# EAGLE design Hooly_2.022 (EAGLE 8.5.1)
SHT31 con connettore Tutto 1206 anzichè 0603 Con regolatore all'ingresso Variante Con quarzo non SMD Partitore a VBATT per misurare livello batteria
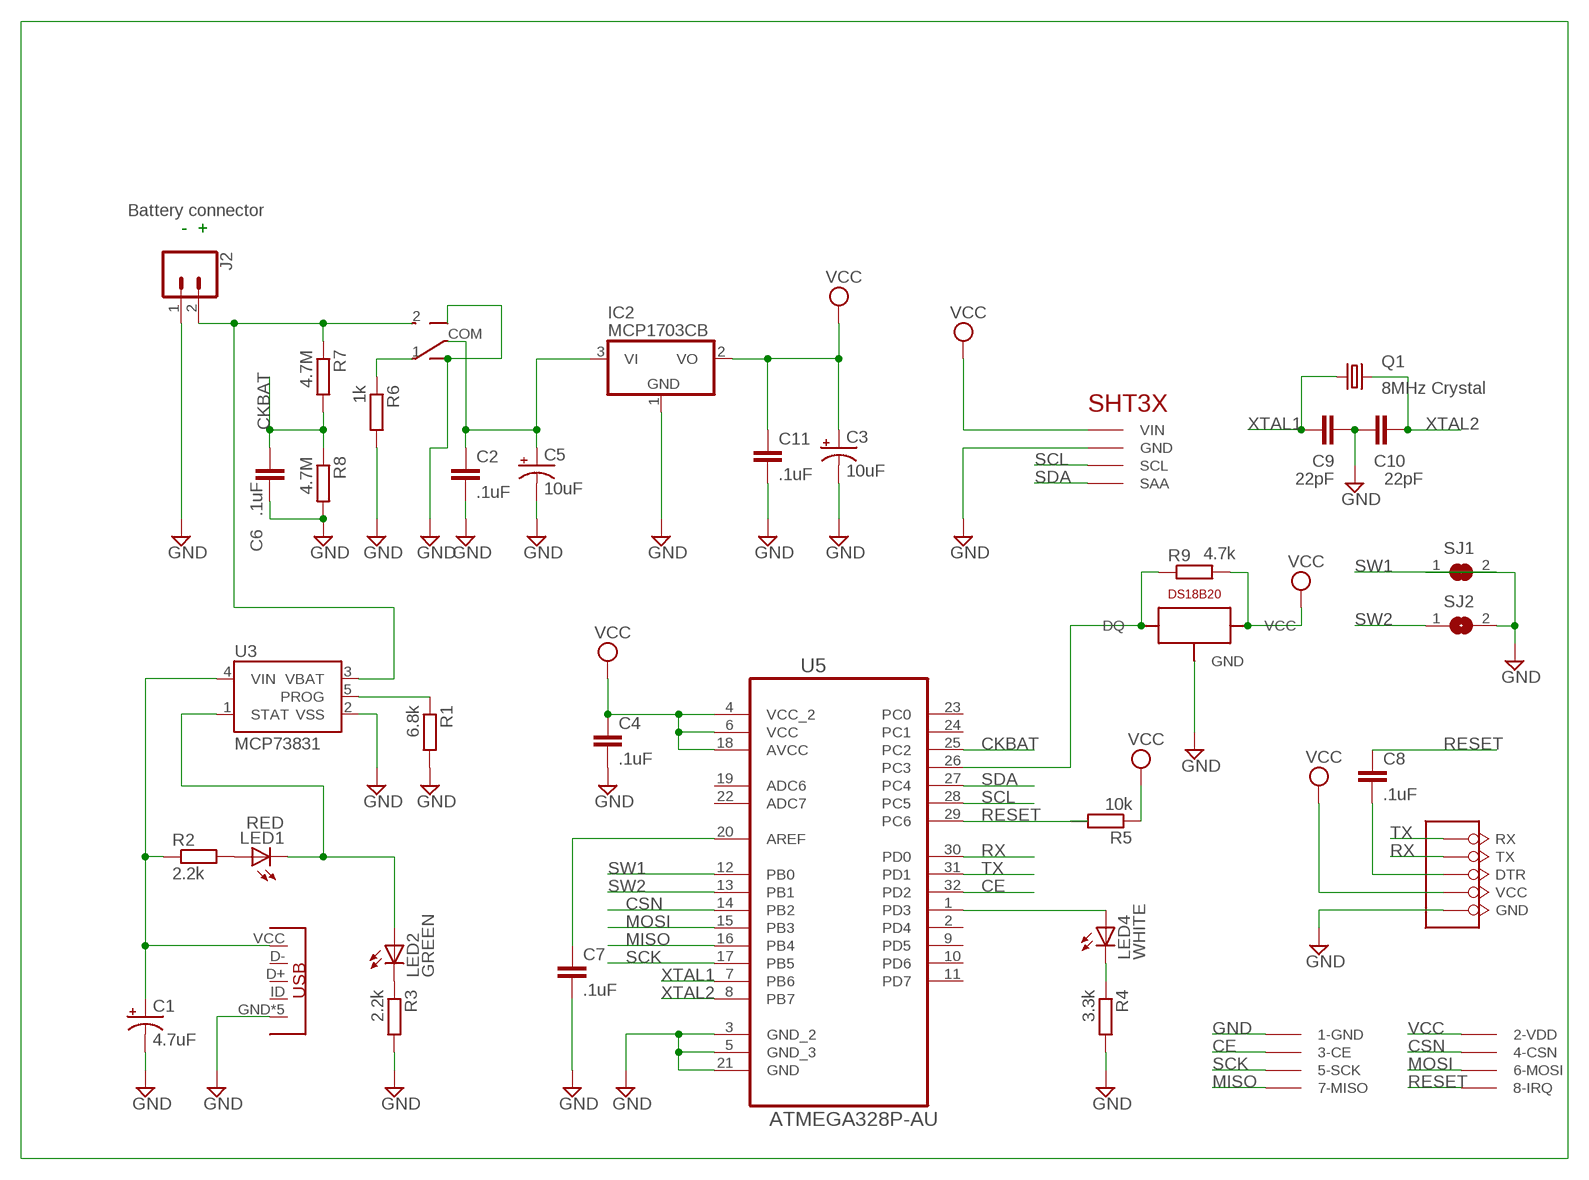
[diagram p0: schematic, sheet 1]

## Parts
C1  4.7uF  10UF-POLAR-RADIAL-2.5MM-25V-20%  [CPOL-RADIAL-2.5MM-5MM]
C2  .1uF  C-EUC1206  [C1206]
C3  10uF  10UF-POLAR-RADIAL-2.5MM-25V-20%  [CPOL-RADIAL-2.5MM-5MM]
C4  .1uF  C-EUC1206  [C1206]
C5  10uF  10UF-POLAR-RADIAL-2.5MM-25V-20%  [CPOL-RADIAL-2.5MM-5MM]
C6  .1uF  C-EUC1206  [C1206]
C7  .1uF  C-EUC1206  [C1206]
C8  .1uF  C-EUC1206  [C1206]
C9  22pF  C-EUC0603K  [C0603K]
C10  22pF  C-EUC0603K  [C0603K]
C11  .1uF  C-EUC1206  [C1206]
IC2  MCP1703CB  [SOT23]
J2  CONN_02  [1X02]
LED1  RED  LEDCHIPLED_1206  [CHIPLED_1206]
LED2  GREEN  LEDCHIPLED_1206  [CHIPLED_1206]
LED4  WHITE  LEDCHIPLED_1206  [CHIPLED_1206]
Q1  8MHz Crystal  KX-9B  [5.0X3.2_2]
R1  6.8k  R-EU_R1206  [R1206]
R2  2.2k  R-EU_R1206  [R1206]
R3  2.2k  R-EU_R1206  [R1206]
R4  3.3k  R-EU_R1206  [R1206]
R5  10k  R-EU_R1206  [R1206]
R6  1k  R-EU_R1206  [R1206]
R7  4.7M  R-EU_R1206  [R1206]
R8  4.7M  R-EU_R1206  [R1206]
R9  4.7k  R-EU_R1206  [R1206]
SJ1  SJ  [SJ]
SJ2  SJ  [SJ]
U3  MCP73831  [SOT23-5]
U5  ATMEGA328P-AU  [QFP80P900X900X120-32N]
U$1  SHT3XLARGE  [MYSHT3X]
U$2  MYSWITCH2MM  [MYSWITCH]
U$3  MYDS18B20  [MYDS18B20]
U$4  MYNRF24L01SOCKET  [MYNRF24L01SOCKET]
U$6  FTDI232  [FTDI232]
U$7  MYMICROUSB  [MYMICROUSB]

## Nets
CE: U5.32(PD2) U$4.CE(3-CE)
CKBAT: C6.1 R7.2 R8.1 U5.25(PC2)
CSN: U5.14(PB2) U$4.CSN(4-CSN)
DTR: C8.2 U$6.DTR
GND: C1.2(-) C2.2 C3.2(-) C4.2 C5.2(-) C6.2 C7.2 C9.2 C10.1 C11.2 IC2.1(GND) J2.1 R1.2 R3.2 R4.2 R6.2 R8.2 SJ1.1 SJ2.2 U3.2(VSS) U5.3(GND_2) U5.5(GND_3) U5.21(GND) U$1.GND U$2.GND1 U$2.GND2 U$3.GND U$4.GND(1-GND) U$6.GND U$7.GND U$7.P$6(GND) U$7.P$7(GND) U$7.P$8(GND) U$7.P$9(GND)
MISO: U5.16(PB4) U$4.MISO(7-MISO)
MOSI: U5.15(PB3) U$4.MOSI(6-MOSI)
N$2: C2.1 C5.1(+) IC2.3(VI) U$2.COM
N$3: LED4.A U5.1(PD3)
N$5: LED1.A R2.2
N$7: LED2.C R3.1
N$8: LED1.C LED2.A U3.1(STAT)
N$9: R6.1 U$2.1
N$10: R1.1 U3.5(PROG)
N$12: C7.1 U5.20(AREF)
N$13: R9.1 U5.26(PC3) U$3.DQ
N$14: LED4.C R4.1
RESET: C8.1 R5.2 U5.29(PC6) U$4.IRQ(8-IRQ)
RX: U5.30(PD0) U$6.TX
SCK: U5.17(PB5) U$4.SCK(5-SCK)
SCL: U5.28(PC5) U$1.SCL
SDA: U5.27(PC4) U$1.SAA
SW1: SJ1.2 U5.12(PB0)
SW2: SJ2.1 U5.13(PB1)
TX: U5.31(PD1) U$6.RX
VBATT: J2.2 R7.1 U3.3(VBAT) U$2.2
VCC: C3.1(+) C4.1 C11.1 IC2.2(VO) R5.1 R9.2 U5.4(VCC_2) U5.6(VCC) U5.18(AVCC) U$1.VIN U$3.VCC U$4.VDD(2-VDD) U$6.VCC
VUSB: C1.1(+) R2.1 U3.4(VIN) U$7.VCC
XTAL1: C9.1 Q1.1 U5.7(PB6)
XTAL2: C10.2 Q1.2 U5.8(PB7)
Unconnected: U5.2(PD4) U5.9(PD5) U5.10(PD6) U5.11(PD7) U5.19(ADC6) U5.22(ADC7) U5.23(PC0) U5.24(PC1) U$7.D+ U$7.D- U$7.ID

## Notes on the sheet
- Battery connector
- -  + | -  + | -  + | -  + | -  +

## Library data of the parts
C1 = SparkFun-Capacitors:10UF-POLAR: 10.0µF polarized capacitors A capacitor is a passive two-terminal electrical component used to store electrical energy temporarily in an electric field.; PROD_ID: CAP-08440; VALUE: 10uF
C2 C4 C6-C8 C11 = resistor:C-EU: CAPACITOR, European symbol
C3 C5 = SparkFun-Capacitors:10UF-POLAR: 10.0µF polarized capacitors A capacitor is a passive two-terminal electrical component used to store electrical energy temporarily in an electric field.; PROD_ID: CAP-08440
C9 C10 = rcl:C-EU: CAPACITOR, European symbol; SPICEPREFIX: C
IC2 = linear:MCP1703: 250 mA, 16V, Low Quiescent Current LDO Regulator Source: http://ww1.microchip.com/downloads/en/DeviceDoc/22049b.pdf
J2 = SparkFun-Connectors:CONN_02: Multi connection point. Often used as Generic Header-pin footprint for 0.1 inch spaced/style header connections On any of the 0.1 inch spaced packages, you can populate with these: Break Away Headers - Straight <https://www.sparkfun.com/products/116> (PRT-00116) Break Away Male Headers - Right Angle <https://www.sparkfun.com/products/553> (PRT-00553) Female Headers <https://www.sparkfun.com/products/115> (PRT-00115) Break Away Headers - Machine Pin <https://www.sparkfun.com/products/117> (PRT-00117) Break Away Female Headers - Swiss Machine Pin <https://www.sparkfun.com/products/743> (PRT-00743) For SCREWTERMINALS and SPRING TERMINALS visit here: Screw Terimnals on SparkFun.com <https://www.sparkfun.com/search/results?term=Screw+Terminals> (5mm/3.5mm/2.54mm spacing) This device is also useful as a general connection point to wire up your design to another part of your project. Our various solder wires solder well into these plated through hole pads. Hook-Up Wire - Assortment (Stranded, 22 AWG) <https://www.sparkfun.com/products/11375> (PRT-11375) Hook-Up Wire - Assortment (Solid Core, 22 AWG) <https://www.sparkfun.com/products/11367> (PRT-11367) View the entire wire category on our website here <https://www.sparkfun.com/categories/141> Special notes: Molex polarized connector foot print use with: PRT-08233 with associated crimp pins and housings. 2.54_SCREWTERM for use with PRT-10571. 3.5mm Screw Terminal footprints for PRT-08084 5mm Screw Terminal footprints for use with PRT-08432
LED1 LED2 LED4 = led:LED: LED OSRAM: - CHIPLED LG R971, LG N971, LY N971, LG Q971, LY Q971, LO R971, LY R971 LH N974, LH R974 LS Q976, LO Q976, LY Q976 LO Q996 - Hyper CHIPLED LW Q18S LB Q993, LB Q99A, LB R99A - SideLED LS A670, LO A670, LY A670, LG A670, LP A670 LB A673, LV A673, LT A673, LW A673 LH A674 LY A675 LS A676, LA A676, LO A676, LY A676, LW A676 LS A679, LY A679, LG A679 - Hyper Micro SIDELED® LS Y876, LA Y876, LO Y876, LY Y876 LT Y87S - SmartLED LW L88C, LW L88S LB L89C, LB L89S, LG L890 LS L89K, LO L89K, LY L89K LS L896, LA L896, LO L896, LY L896 - TOPLED LS T670, LO T670, LY T670, LG T670, LP T670 LSG T670, LSP T670, LSY T670, LOP T670, LYG T670 LG T671, LOG T671, LSG T671 LB T673, LV T673, LT T673, LW T673 LH T674 LS T676, LA T676, LO T676, LY T676, LB T676, LH T676, LSB T676, LW T676 LB T67C, LV T67C, LT T67C, LS T67K, LO T67K, LY T67K, LW E67C LS E67B, LA E67B, LO E67B, LY E67B, LB E67C, LV E67C, LT E67C LW T67C LS T679, LY T679, LG T679 LS T770, LO T770, LY T770, LG T770, LP T770 LB T773, LV T773, LT T773, LW T773 LH T774 LS E675, LA E675, LY E675, LS T675 LS T776, LA T776, LO T776, LY T776, LB T776 LHGB T686 LT T68C, LB T68C - Hyper Mini TOPLED® LB M676 - Mini TOPLED Santana® LG M470 LS M47K, LO M47K, LY M47K Source: http://www.osram.convergy.de LUXEON: - LUMILED® LXK2-PW12-R00, LXK2-PW12-S00, LXK2-PW14-U00, LXK2-PW14-V00 LXK2-PM12-R00, LXK2-PM12-S00, LXK2-PM14-U00 LXK2-PE12-Q00, LXK2-PE12-R00, LXK2-PE12-S00, LXK2-PE14-T00, LXK2-PE14-U00 LXK2-PB12-K00, LXK2-PB12-L00, LXK2-PB12-M00, LXK2-PB14-N00, LXK2-PB14-P00, LXK2-PB14-Q00 LXK2-PR12-L00, LXK2-PR12-M00, LXK2-PR14-Q00, LXK2-PR14-R00 LXK2-PD12-Q00, LXK2-PD12-R00, LXK2-PD12-S00 LXK2-PH12-R00, LXK2-PH12-S00 LXK2-PL12-P00, LXK2-PL12-Q00, LXK2-PL12-R00 Source: www.luxeon.com KINGBRIGHT: KA-3528ASYC Source: www.kingbright.com
Q1 = crystal-geyer_V1_0:KX: Quartz Crystals (MHz) SMD: KX - Serie Model Size l/w/h [mm] Frequency Range Frequency Stability Temp. Range [°C] Load Capacitance AECQ 200 availabel Datasheet KX-4 KX-5 KX-6 KX-7 KX-9A KX-9B KX-12A KX-12B KX-13 KX-20 KX-K KX-KS 1.6/1.2/0.3 2.0/1.6/0.45 2.5/2.0/0.55 3.2/2.5/0.8 5.0/3.2/1.0 5.0/3.2/1.1 6.0/3.5/1.1 6.0/3.5/1.0 7.0/5.0 /1.3 11.6/5.5/1.6 12.3/4.5/4.2 12.3/4.5/3.2 24.0 ~ 80.0 MHz 16.0 ~ 80.0 MHz 12.0 ~ 80.0 MHz 8.0 ~ 60.0 MHz 7,68 ~ 300,0 MHz 8,0 ~ 50,0 MHz 8,0 ~ 150,0 MHz 8,0 ~ 50,0 MHz 6,0 ~ 160,0 MHz 3,579 ~ 25,0 MHz 3,579 ~ 70,0 MHz 3,579 ~ 70,0 MHz ±10 … ±50ppm ±10 … ±50ppm ±10 … ±50ppm ±10 … ±50ppm ±10 … ±50ppm ±10 … ±50ppm ±10 … ±50ppm ±10 … ±50ppm ±10 … ±50ppm ±50ppm ±10 … ±50ppm ±10 … ±50ppm (*) -40°C …+85°C (*) -40°C …+125°C (*) -40°C …+125°C (*) -40°C …+125°C (*) -40°C …+105°C (*) -40°C …+105°C (*) -40°C …+125°C (*) -40°C …+105°C (*) -40°C …+105°C (*) -40°C …+105°C (*) -40°C …+85°C (*) -40°C …+85°C 8, 8…16 8, 8…16 10, 8…16 12, 7…20 16, 10…20 16, 10…20 16, 10…20 16, 12…20 16, 12…20 16, 12…20 16, 12…30 16, 12…30 - yes yes yes - - - - - - - - KX-4.pdf <http://www.geyer-electronic.de/uploads/tx_userartikelfrequenz/GEYER-KX-4.pdf> KX-5.pdf <http://www.geyer-electronic.de/uploads/tx_userartikelfrequenz/GEYER-KX-5.pdf> KX-6.pdf <http://www.geyer-electronic.de/uploads/tx_userartikelfrequenz/GEYER-KX-6.pdf> KX-7.pdf <http://www.geyer-electronic.de/uploads/tx_userartikelfrequenz/GEYER-KX-7.pdf> KX-9A.pdf <http://www.geyer-electronic.de/uploads/tx_userartikelfrequenz/GEYER-KX-9A.pdf> KX-9B.pdf <http://www.geyer-electronic.de/uploads/tx_userartikelfrequenz/GEYER-KX-9B.pdf> KX-12A.pdf <http://www.geyer-electronic.de/uploads/tx_userartikelfrequenz/GEYER-KX-12A.pdf> KX-12B.pdf <http://www.geyer-electronic.de/uploads/tx_userartikelfrequenz/GEYER-KX-12B.pdf> KX-13.pdf <http://www.geyer-electronic.de/uploads/tx_userartikelfrequenz/GEYER-KX-13.pdf> KX-20.pdf <http://www.geyer-electronic.de/uploads/tx_userartikelfrequenz/GEYER-KX-20.pdf> KX-K.pdf <http://www.geyer-electronic.de/uploads/tx_userartikelfrequenz/GEYER-KX-K.pdf> KX-KS.pdf <http://www.geyer-electronic.de/uploads/tx_userartikelfrequenz/GEYER-KX-KS.pdf> <http://www.geyer-electronic.de/fileadmin/template/img/logo-geyer-electronic.png> Details see: http://www.geyer-electronic.de/Frequenz-Produkte.9.0.html Created 2016-06-07, Hans Locher 2016 (C) Geyer Quartz Technology KX4,KX5,KX6,KX7,KX9A,KX9B,KX12A,KX12B,KX13,KX20,KXK,KXKS;1612;2016;2520;3225;5032;6035;7050;11655;12345;1,6x1,2;2,0x1,6;2,5x2,0;3,2x2,5;5,0x3,2;6,0x3,5;7,0x5,0;11,6x5,5;12,3x4,5;12,3x4,5;1.6x1.2;2.0x1.6;2.5x2.0;3.2x2.5;5.0x3.2;6.0x3.5;7.0x5.0;11.6x5.5;12.3x4.5;12.3x4.5;
R1-R9 = rcl:R-EU_: RESISTOR, European symbol
SJ1 SJ2 = jumper:SJ: SMD solder JUMPER
U3 = SparkFun-IC-Power:MCP73831: MCP73831T Li-Ion, Li-Pol Controller Miniature single cell, fully integrated Li-Ion, Li-polymer charge management controller Datasheet <http://ww1.microchip.com/downloads/en/DeviceDoc/20001984g.pdf> SparkFun Products: SparkFun ESP32 Thing <https://www.sparkfun.com/products/13907> SparkFun 9DoF Razor IMU M0 <https://www.sparkfun.com/products/14001>; PROD_ID: IC-09995
U5 = Atmel_By_element14_Batch_1-00:ATMEGA328P-AU: 8-bit Microcontroller with In-System Programmable Flash; MPN: ATMEGA328P-AU; OC_FARNELL: 1715486; OC_NEWARK: 14R4631; PACKAGE: TQFP-32; SUPPLIER: Atmel
U$1 = My_library:SHT3X
U$2 = My_library:MYSWITCH2MM: Slide switch 2mm pitch
U$3 = My_library:MYDS18B20
U$4 = My_library:MYNRF24L01SOCKET
U$6 = My_library:FTDI232
U$7 = My_library:MYMICROUSB: MicroUSB connectori SMD https://it.aliexpress.com/item/100pcs-Micro-USB-Connector-5pin-Seat-Jack-Micro-usb-Four-legs-5P-Inserting-plate-seat-MIni/32708224969.html?spm=a2g0s.13010208.99999999.262.eblQws

## Net classes
0 default: clearance 0.508 mm

## Board
// Funziona, provato con Hooly 2.021 autocostruito #include #include "Adafruit_SHT31.h" #include #include #include #define ledPin 3 #define ECP 1 // EEPROM register where store info for pause between trasmission #define NETWORKID 0 // Must be the same for all nodes #define MYNODEID 2 // Trasmitter node ID #define TONODEID 1 // Destination node ID #define FREQUENCY RF69_433MHZ Adafruit_SHT31 sht31 = Adafruit_SHT31(); RFM69 radio; int counter=0; int nodeID=5555; int period=5; // ------------------------- void setup() { pinMode(ledPin, OUTPUT); Serial.begin(57600); sht31.begin(0x44); radio.initialize(FREQUENCY, MYNODEID, NETWORKID); radio.setHighPower(); } // ------------------------- void loop() { delay(10); char outBuffer[32]= ""; byte outBufferLen; long start_timer=millis(); int temp = sht31.readTemperature() * 100; int hum = sht31.readHumidity() * 100; long vcc = readVcc(); int b = nodeID; int c = counter; int dt = temp; int dh = hum; int e = vcc; int f = period; sprintf(outBuffer, "%04d:%04d:%04d:%04d:%04d:%04d",b,c,dt,dh,e,f); outBufferLen = strlen(outBuffer); Serial.print("Vcc = "); Serial.println(vcc); Serial.print("Temp *C = "); Serial.println(temp); Serial.print("Hum. % = "); Serial.println(hum); Serial.print("Measurament time = "); Serial.println((millis() - start_timer)); start_timer=millis(); Serial.print("Counter = "); Serial.println(counter); Serial.println(outBuffer); digitalWrite(ledPin, HIGH); radio.send(TONODEID, outBuffer, outBufferLen); delay(10); digitalWrite(ledPin, LOW); Serial.print("Trasmission time = "); Serial.println((millis() - start_timer)); Serial.println(); if(counter == 9999) counter = 0; else counter ++; delay(10); gotosleep(period); delay(10); } // ------------------------- void gotosleep(int period) { int timer = period; while (timer > 0) { if (timer > 8) { LowPower.powerDown(SLEEP_8S, ADC_OFF, BOD_OFF); timer = timer -8; } else { LowPower.powerDown(SLEEP_1S, ADC_OFF, BOD_OFF); timer = timer -1; } } } // ------------------------- long readVcc() { ADMUX = _BV(REFS0) | _BV(MUX3) | _BV(MUX2) | _BV(MUX1); delay(2); // Wait for Vref to settle ADCSRA |= _BV(ADSC); // Start conversion while (bit_is_set(ADCSRA,ADSC)); // measuring uint8_t low = ADCL; // must read ADCL first - it then locks ADCH uint8_t high = ADCH; // unlocks both long result = (high<<8) | low; result = 1125300L / result; // Calculate Vcc (in mV); 1125300 = 1.1*1023*1000 return result; // Vcc in millivolts }
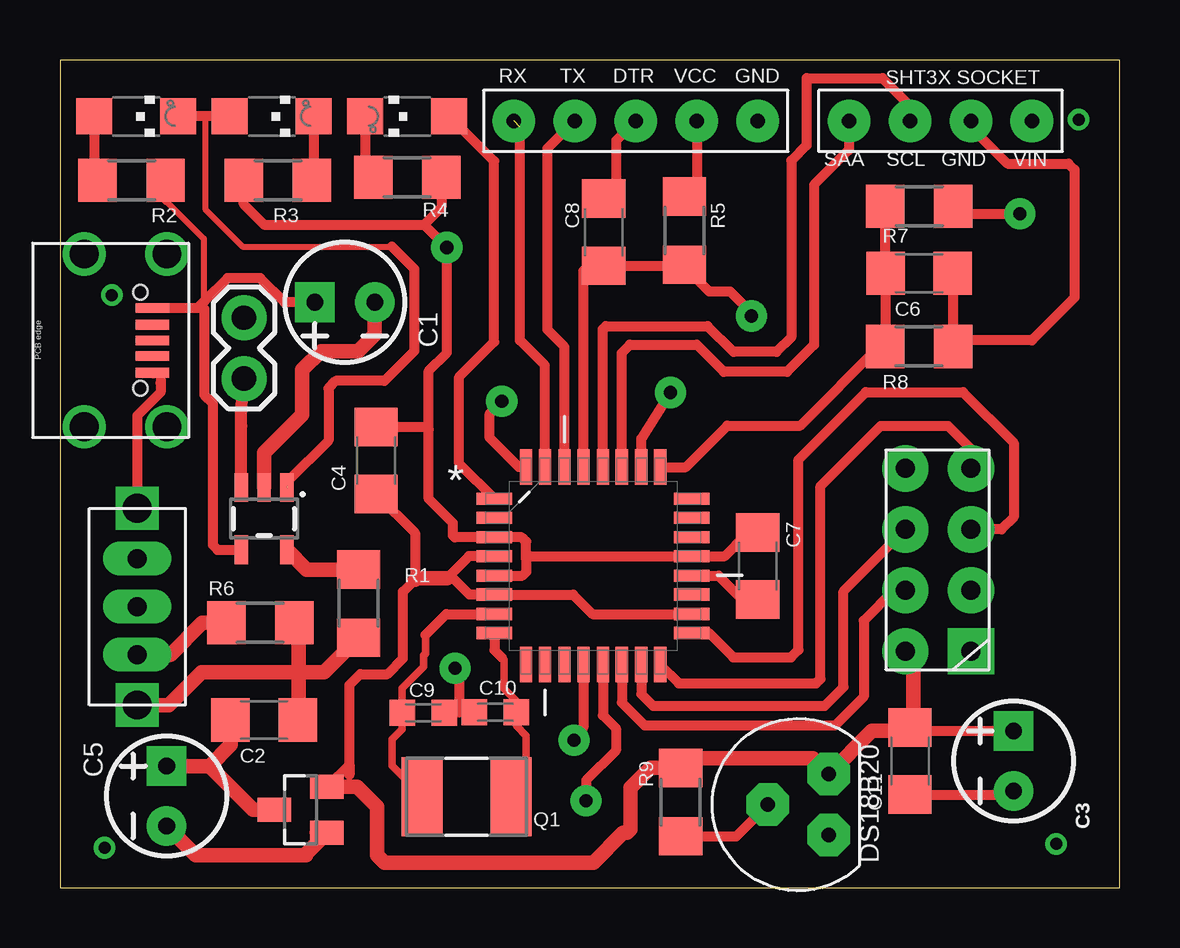
[diagram p1: board, top side]
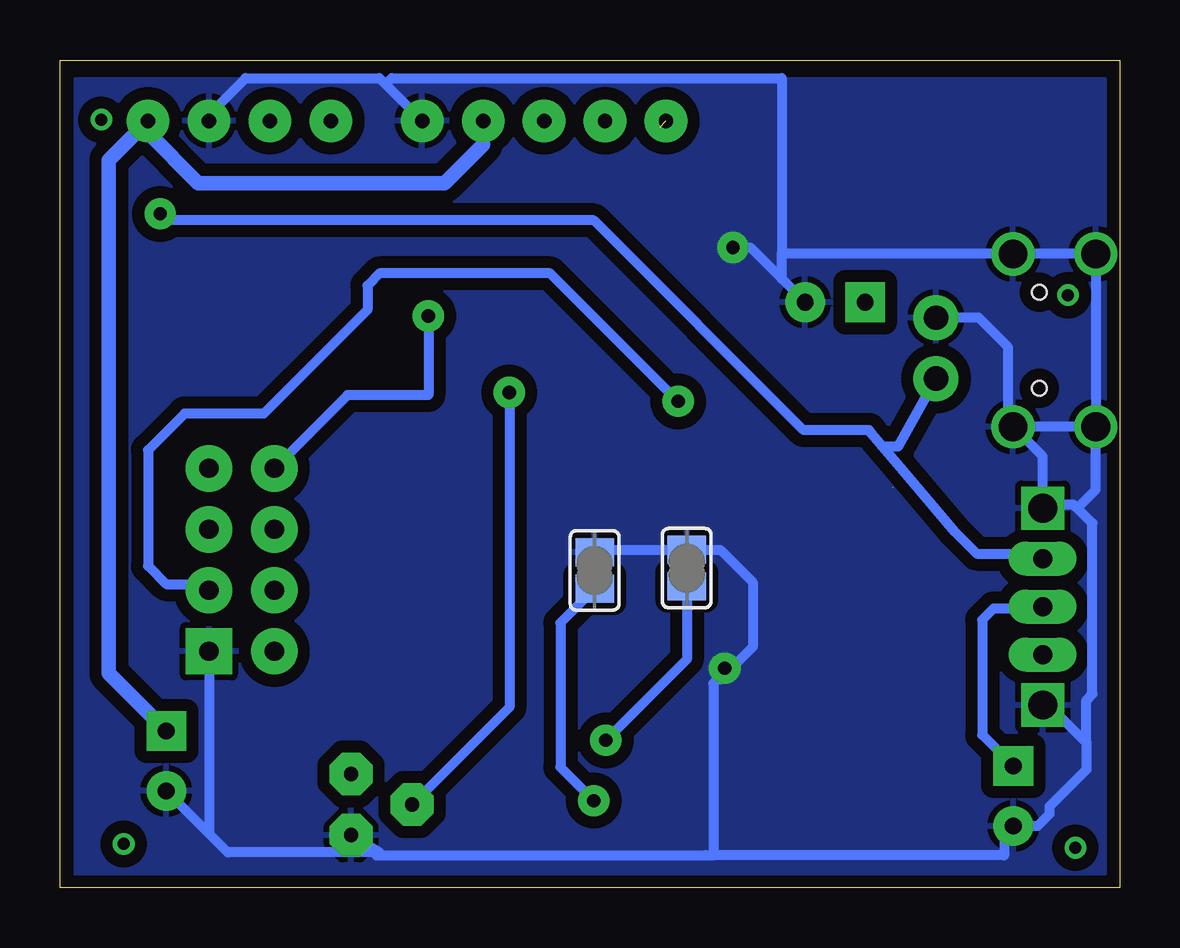
[diagram p2: board, bottom side, seen from below]

Size 44.18 x 34.5 mm. Coordinates in mm from the lower left corner, seen from the top.
Outline: 0,0 44.18,0 44.18,34.5 0,34.5 0,0
Copper layers (1*16): Top 0.035mm / dielectric 1.5mm / Bottom 0.035mm
Design rules "default *": minimum track width 6mil, minimum drill 0.35mm, track to track 10mil, track to pad 10mil, pad to pad 10mil, via to via 10mil, smd to smd 6mil, copper to edge 20mil, drill to drill 2mil, minimum pad ring 10mil, minimum via ring 8mil, stop-mask expansion 4mil, vias tented up to drill 0mil, thermal gap 10mil

### Footprints (pad centres in the part's own frame; a part is rotated, then mirrored left to right if it is on the bottom)
CPOL-RADIAL-2.5MM-5MM = drill 0.7 pad 1.651 square: 1 1.25,0 | drill 0.7 pad 1.651: 2 -1.25,0
C1206 = smd 1.6 x 1.8: 1 -1.4,0; 2 1.4,0
C0603K = smd 1.05 x 1.08: 1 -0.875,0; 2 0.875,0
SOT23 = smd 1 x 1.4: 1 -0.95,-1.1; 2 0.95,-1.1; 3 0,1.1
1X02 = drill 1.016 pad 1.88: 1 0,0; 2 2.54,0
CHIPLED_1206 = smd 1.5 x 1.5: A 0,-1.75; C 0,1.75
5.0X3.2_2 = smd 1.7 x 3.3: 1 -1.85,0; 2 1.85,0
R1206 = smd 1.6 x 1.803: 1 -1.422,0; 2 1.422,0
SJ = smd 1.168 x 1.6: 1 -0.762,0; 2 0.762,0
SOT23-5 = smd 0.55 x 1.2: 1 -0.95,-1.3; 2 0,-1.3; 3 0.95,-1.3; 4 0.95,1.3; 5 -0.95,1.3
QFP80P900X900X120-32N = smd 1.473 x 0.508: 1 -4.115,2.794; 2 -4.115,2.007; 3 -4.115,1.194; 4 -4.115,0.406; 5 -4.115,-0.406; 6 -4.115,-1.194; 7 -4.115,-2.007; 8 -4.115,-2.794; 17 4.115,-2.794; 18 4.115,-2.007; 19 4.115,-1.194; 20 4.115,-0.406; 21 4.115,0.406; 22 4.115,1.194; 23 4.115,2.007; 24 4.115,2.794 | smd 0.508 x 1.473: 9 -2.794,-4.115; 10 -2.007,-4.115; 11 -1.194,-4.115; 12 -0.406,-4.115; 13 0.406,-4.115; 14 1.194,-4.115; 15 2.007,-4.115; 16 2.794,-4.115; 25 2.794,4.115; 26 2.007,4.115; 27 1.194,4.115; 28 0.406,4.115; 29 -0.406,4.115; 30 -1.194,4.115; 31 -2.007,4.115; 32 -2.794,4.115
MYSHT3X = drill 0.6 pad 1.778: GND -3.81,0; SAA 1.27,0; SCL -1.27,0; VIN -6.35,0
MYSWITCH = drill 0.8 pad 1.422 long: 1 -2,0; 2 2,0; COM 0,0 | drill 1.2 square: GND1 -4.1,0; GND2 4.1,0
MYDS18B20 = drill 0.6 pad 1.778 octagon: DQ 0,-1.27; GND 1.27,1.27; VCC -1.27,1.27
MYNRF24L01SOCKET = drill 0.8 pad 1.93: CE 0,2.54; CSN -2.731,2.54; IRQ -2.731,7.62; MISO 0,7.62; MOSI -2.731,5.08; SCK 0,5.08; VDD -2.731,0 | drill 0.8 pad 1.93 square: GND 0,0
FTDI232 = drill 0.6 pad 1.778: DTR 3.81,0; GND 8.89,0; RX -1.27,0; TX 1.27,0; VCC 6.35,0
MYMICROUSB = smd 0.4 x 1.4: D+ 0,5; D- -0.65,5; GND 1.35,5; ID 0.65,5; VCC -1.35,5 | drill 1.2: P$6 -3.6,2.15; P$7 3.6,2.15; P$8 3.6,5.6; P$9 -3.6,5.6 | hole 0.6: -2,4.5; 2,4.5

### Placement (x,y rotation side)
C1  11.87,24.4 180 top
C2  8.51,6.99 0 top
C3  39.75,5.29 90 top
C4  13.18,17.81 90 top
C5  4.45,3.83 90 top
C6  35.81,25.61 0 top
C7  29.08,13.42 90 top
C8  22.67,27.32 90 top
C9  15.14,7.3 0 top
C10  18.15,7.32 0 top
C11  35.43,5.29 270 top
IC2  10.03,3.26 90 top
J2  7.67,23.76 270 top
LED1  3.17,32.15 270 top
LED2  8.83,32.15 270 top
LED4  14.48,32.15 90 top
Q1  16.95,3.8 0 top
R1  12.45,11.84 270 top
R2  2.98,29.48 180 top
R3  9.08,29.48 180 top
R4  14.48,29.61 0 top
R5  26.04,27.39 270 top
R6  8.35,11.04 0 top
R7  35.81,28.4 180 top
R8  35.81,22.56 0 top
R9  25.87,3.57 90 top
SJ1  18.06,13.33 270 bottom
SJ2  21.9,13.23 90 bottom
U3  8.51,15.38 180 top
U5  22.22,13.42 0 top
U$1  34.16,31.96 180 top
U$2  3.22,11.72 90 top
U$3  30.78,3.47 270 top
U$4  37.97,9.86 0 top
U$6  20.19,31.96 0 top
U$7  -1.14,22.81 270 top

### Tracks (layer width: path | path; a pad name or v marks a point on that pad's centre or on a via)
CE  (via drill 0.55 pad 1.3)
  Top 0.152: 19.46,17.45 U5.32
  Top 0.406: U5.32 19.13,17.53 17.91,18.75 17.91,19.77 v18.41,20.27
  Bottom 0.406: U$4.CE 38.23,12.65 39.75,12.65 40.51,13.42 40.51,18.24 38.99,19.77 35.69,19.77 31.37,24.08 31.37,25.1 30.86,25.61 23.75,25.61 v18.41,20.27
CKBAT
  Top 0.406: U5.25 26.09,17.53 27.81,19.26 30.86,19.26 34.19,22.58 34.41,22.58 | R7.2 34.39,25.63 C6.1 34.41,22.58 | 34.41,22.58 R8.1
CSN
  Top 0.406: U5.14 23.42,7.72 24.38,6.76 32.3,6.76 33.51,7.97 33.51,11.14 34.77,12.4 U$4.CSN
DTR
  Top 0.406: U$6.DTR 23.18,31.13 23.18,28.66 22.74,28.66 C8.2
GND  (via drill 0.55 pad 1.3)
  Top 0.305: C9.2 16.63,7.3 17.41,7.3 C10.1
  Top 0.406: 19.43,13.67 19.43,13.16 19.28,13.01 U5.5 | 19.43,13.67 19.43,14.43 19.25,14.61 U5.3 16.46,14.61 16.38,14.69 16.38,15.19 15.37,16.21 15.37,19.1 | 19.43,13.67 19.58,13.82 U5.21 27.71,13.82 28.57,14.69 28.95,14.69 C7.2 | U$2.GND1 3.98,7.62 | 12.55,9.86 R1.2 | C11.2 39.6,3.89 C3.2 | U$1.GND 37.97,31.7 39.5,30.18 42.04,30.18 42.29,29.93 42.29,24.59 40.51,22.81 37.49,22.81 R8.2 37.21,22.58 C6.2 | R3.2 7.66,28.49 8.51,27.64 15.18,27.64 | 15.88,29.16 15.88,29.58 R4.2 15.9,28.36 15.18,27.64 | U$7.GND 4.18,21.45 | 4.18,21.45 4.19,21.04 4.19,20.65 3.22,19.68 U$2.GND2 | 15.37,19.1 15.37,21.54 16.13,22.31 v16.13,26.69 15.18,27.64 | IC2.1 10.61,2.31 | C4.2 15.26,19.21 15.37,19.1 | U$7.GND 3.89,21.43 | v16.47,9.15 16.63,8.99 16.63,7.3 | U$7.GND 4.17,21.46 4.18,21.45
  Top 0.61: C5.2 5.66,1.36 10.26,1.36 10.26,1.43 IC2.1 | U$2.GND1 4.53,7.62 5.9,8.99 9.94,8.99 | 9.94,8.99 9.94,10.88 R6.2 | 9.94,8.99 9.94,7.03 C2.2 | R1.2 11.02,8.99 9.94,8.99 | U3.2 8.51,18.13 10.1,19.72 10.1,21.59 10.88,22.37 12.43,22.37 13.12,23.06 C1.2
  Bottom 0.406: U$2.GND1 2.96,7.62 1.4,6.05 | 31.11,1.48 30.86,1.48 U$3.GND | 31.11,1.48 37.19,1.48 37.97,2.26 | 37.97,2.26 C3.2 | 1.4,6.05 1.4,7.83 1.14,8.08 1.14,15.19 1.78,15.83 | 1.78,15.83 1.91,15.96 3.08,15.96 U$2.GND2 | 2.92,16.12 U$2.GND2 | U$7.P$7 1.01,16.6 1.78,15.83 | U$7.P$7 U$7.P$6 U$7.P$9 14.08,26.41 14.1,26.43 | U$2.GND2 3.22,17.98 U$7.P$8 | 37.97,32.47 U$1.GND 37.97,32.21 36.45,33.74 30.86,33.74 30.61,33.48 | 30.61,33.48 U$6.GND | 30.61,33.48 30.35,33.74 14.1,33.74 14.1,26.43 | U$7.P$7 U$7.P$8 | U$4.GND 37.97,2.26 | 31.11,1.48 30.99,1.35 17.29,1.35 | 17.29,1.35 16.94,1.35 | 16.94,1.35 4.83,1.35 4.83,2.2 C5.2 3.44,2.58 2.94,3.08 2.94,3.39 1.4,4.93 1.4,6.05 | SJ2.2 21.8,14.09 SJ1.1 16.66,14.09 15.31,12.73 15.31,10.05 16.67,8.68 v16.47,9.15 16.94,8.52 16.94,1.35 | 17.26,1.38 17.29,1.35 | C1.2 14.1,25.37 | 14.1,25.37 14.1,26.43 | v16.13,26.69 15.41,26.69 14.1,25.37 | U$7.P$8 4.66,19.41 4.66,22.52 5.89,23.76 J2.1
  pour Bottom: 43.55,33.72 43.55,0.59 43.7,0.43 0.77,0.43 0.61,0.59 0.61,33.72
MISO
  Top 0.406: U5.16 25.8,8.52 31.52,8.52 31.7,8.7 31.7,16.74 34.21,19.25 37.01,19.25 37.97,18.3 U$4.MISO
MOSI
  Top 0.406: U5.15 24.23,8.08 24.72,7.59 31.88,7.59 32.66,8.37 32.66,12.36 U$4.MOSI
N$2
  Top 0.61: C5.1 6.23,5.08 | IC2.3 8.05,3.26 6.23,5.08 | C2.1 7.11,5.96 6.23,5.08
  Bottom 0.406: U$2.COM 3.3,11.63 5.28,11.63 5.74,11.17 5.74,6.38 C5.1
N$3
  Top 0.406: U5.1 16.64,17.68 16.64,21.29 18.1,22.75 18.1,30.28 LED4.A
N$4  (via drill 0.5)
  other vias: 1.85,1.67
N$5
  Top 0.406: LED1.A 1.43,29.62 R2.2
N$6  (via drill 0.5)
  other vias: 41.53,1.83
N$7
  Top 0.406: LED2.C 10.58,29.56 R3.1
N$8  (1 unrouted)
  Top 0.254: 6.06,32.15 6.06,28.28 7.61,26.72 13.83,26.72
  Top 0.406: LED2.A 6.06,32.15 LED1.C | 9.5,16.68 9.5,16.94 11.19,18.63 11.19,20.81 11.5,21.12 13.52,21.12 14.77,22.37 14.77,25.79 13.83,26.72
N$9
  Top 0.61: U$2.1 4.61,9.72 5.93,11.04 R6.1
N$10
  Top 0.61: U3.5 10.28,13.27 R1.1
N$11  (via drill 0.5)
  other vias: 42.46,32.01
N$12
  Top 0.152: 26.43,13.1 U5.20
  Top 0.406: U5.20 27.46,13.01 28.83,11.64 28.83,11.76 C7.1
N$13  (via drill 0.55 pad 1.3)
  Top 0.406: U5.26 24.23,18.73 v25.45,20.64 | 26.16,2.11 R9.1 28.19,2.15 U$3.DQ
  Bottom 0.406: v25.45,20.64 25.45,7.52 U$3.DQ
N$14
  Top 0.406: LED4.C 12.73,29.94 R4.1
N$15  (via drill 0.5)
  other vias: 2.17,24.7
RESET  (via drill 0.55 pad 1.3)
  Top 0.406: v28.83,23.83 28.83,23.96 27.94,24.85 27.07,24.85 25.99,25.92 | U5.29 21.82,25.71 22.22,26.12 22.42,25.92 C8.1 25.99,25.92 | 25.99,25.92 R5.2
  Bottom 0.406: v28.83,23.83 28.83,20.53 32.2,20.53 U$4.IRQ
RX
  Top 0.254: 20.95,17.61 U5.30
  Top 0.406: U5.30 21.03,22.55 20.32,23.26 20.32,30.82 U$6.TX
SCK
  Top 0.406: U$4.SCK 39.24,14.94 39.75,15.45 39.75,18.54 37.64,20.66 33.59,20.66 31.11,18.18 30.79,17.85 30.79,9.92 30.47,9.61 28.07,9.61 27.05,10.62 U5.17
SCL
  Top 0.406: U5.28 22.63,23.28 22.76,23.41 27,23.41 28.08,22.33 29.87,22.33 30.48,22.94 30.48,30.31 31.11,30.94 31.11,33.74 34.29,33.74 35.43,32.59 U$1.SCL
SDA
  Top 0.152: 23.39,17.56 U5.27
  Top 0.406: U5.27 23.42,22.3 23.75,22.63 26.54,22.63 27.67,21.5 30.31,21.5 31.43,22.62 31.43,29.29 32.89,30.75 U$1.SAA
SW1  (via drill 0.55 pad 1.3)
  Top 0.406: U5.12 21.82,6.69 v21.43,6.15
  Bottom 0.406: SJ1.2 18.06,9.52 v21.43,6.15
SW2  (via drill 0.55 pad 1.3)
  Top 0.406: U5.13 22.63,7.19 23.17,6.65 23.17,5.72 21.93,4.48 v21.93,3.63
  Bottom 0.406: SJ2.1 23.32,11.04 23.32,5.03 v21.93,3.63
TX  (1 unrouted)
  Top 0.254: 20.19,17.56 U5.31
  Top 0.406: U5.31 20.22,21.77 19.18,22.81 19.18,31.7
VBATT  (via drill 0.55 pad 1.3)
  Top 0.406: R7.1 37.55,28.09 v40.01,28.09
  Top 0.508: U3.3 7.56,19.25 7.56,19.86 J2.2
  Bottom 0.406: 9.88,18.39 9.16,17.54 6.86,14.81 5.97,13.92 3.42,13.92 U$2.2 | 9.88,18.39 10.46,19.08 | 10.38,19 10.46,19.08 | J2.2 9.25,18.39 9.88,18.39 | v40.01,28.09 39.73,27.81 21.92,27.81 13.19,19.08 10.46,19.08
VCC
  Top 0.254: 18.11,12.27 U5.6 | 17.37,13.82 U5.4 | 26.31,11.38 U5.18
  Top 0.406: U5.4 17.04,13.82 16.13,12.91 16.38,12.91 17.07,12.22 U5.6 21.39,12.22 22.2,11.41 U5.18 | C3.1 35.58,6.54 C11.1 | 12.06,5.14 IC2.2 | 12.06,5.14 12.06,4.71 | 25.6,4.72 R9.2 | U$6.VCC 26.54,29.32 R5.1 | C4.1 14.8,14.79 14.8,12.85 14.3,12.35 14.3,9.56 13.65,8.91 12.51,8.91 12.06,8.46 12.06,5.14
  Top 0.61: IC2.2 12.39,4.21 13.21,3.39 13.21,1.36 13.52,1.05 22.23,1.05 23.48,2.3 23.63,2.3 23.79,2.45 23.79,4.16 24.62,5 R9.2 26.29,5.41 31.38,5.41 U$3.VCC 33.84,6.54 35.58,6.54 35.58,9.52 U$4.VDD | 16.13,12.91 14.86,12.91 14.8,12.85
  Bottom 0.61: U$6.VCC 26.54,30.97 28.15,29.37 38.41,29.37 40.51,31.47 U$1.VIN 42.15,30.32 42.15,8.94 C3.1
VUSB
  Top 0.254: 4.45,28.66 4.45,28.6 5.99,27.05 5.99,24.46 6.02,24.44
  Top 0.406: U$7.VCC 5.74,24.16 | 5.74,24.16 5.97,24.16 6.02,24.12 6.02,20.53 6.37,20.19 6.37,14.29 6.57,14.08 U3.4 | 4.45,28.66 4.45,29.44 R2.1 | C1.1 9.36,24.4 8.35,25.41 6.99,25.41 6.02,24.44 5.74,24.16
XTAL1
  Top 0.305: 15.23,10.54 15.23,9.76 15.16,9.69 15.16,9.21 14.27,8.31 C9.1 14.27,6.62 13.83,6.19 13.83,5.1 14.75,4.18 14.75,4.15
  Top 0.406: 14.73,4.16 14.75,4.15 Q1.1 | 15.23,10.54 16.1,11.41 U5.7
XTAL2
  Top 0.305: 18.41,9.61 18.52,9.5 18.52,8.29 19.02,7.78 C10.2 19.02,6.75 19.43,6.34 19.43,5.33 19.34,5.23
  Top 0.406: U5.8 18.11,9.91 18.41,9.61 | 19.34,5.23 18.93,4.82 18.93,3.94 Q1.2

### Text on the board
tNames: SHT3X SOCKET
tValues: GND | +